# Altium schematic sheet схема варианта ДСД 23.8.SchDoc
size A3
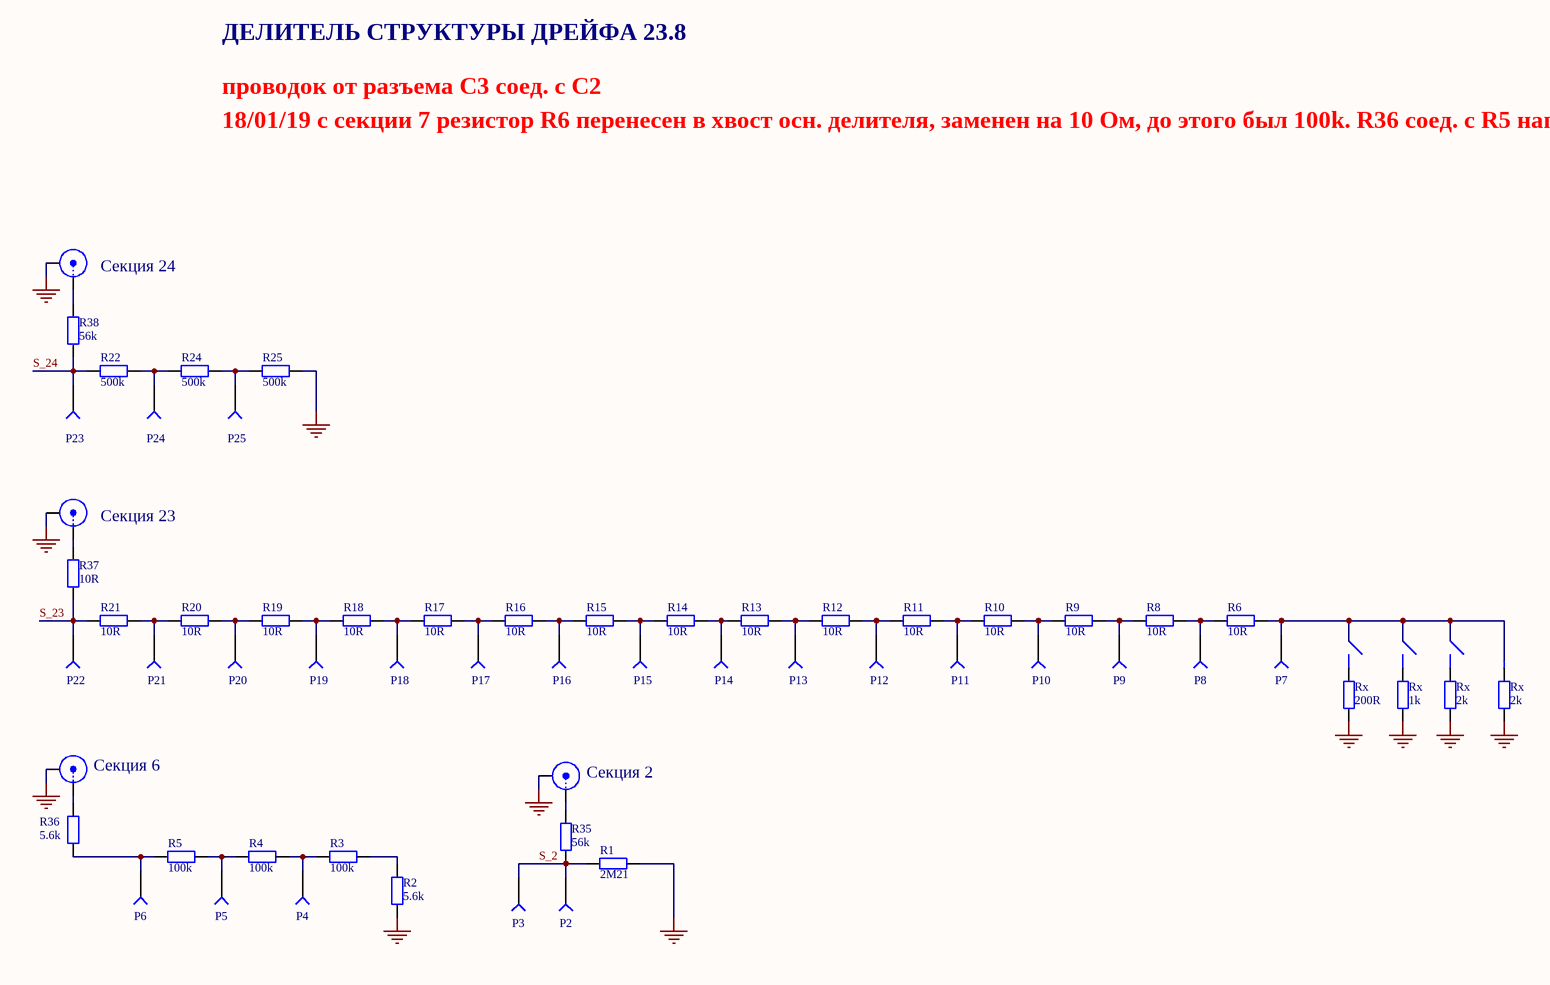
[diagram p0: схема варианта ДСД 23.8.SchDoc]

## Parts
(Parts that share a designator on the sheet are numbered #1, #2 ... from top to bottom, then left to right.)
P2  (no value)  [Pad 2x5mm]  (no BOM)
P3  (no value)  [Pad 2x5mm]  (no BOM)
P4  (no value)  [Pad 2x5mm]  (no BOM)
P5  (no value)  [Pad 2x5mm]  (no BOM)
P6  (no value)  [Pad 2x5mm]  (no BOM)
P7  (no value)  [Pad 2x5mm]  (no BOM)
P8  (no value)  [Pad 2x5mm]  (no BOM)
P9  (no value)  [Pad 2x5mm]  (no BOM)
P10  (no value)  [Pad 2x5mm]  (no BOM)
P11  (no value)  [Pad 2x5mm]  (no BOM)
P12  (no value)  [Pad 2x5mm]  (no BOM)
P13  (no value)  [Pad 2x5mm]  (no BOM)
P14  (no value)  [Pad 2x5mm]  (no BOM)
P15  (no value)  [Pad 2x5mm]  (no BOM)
P16  (no value)  [Pad 2x5mm]  (no BOM)
P17  (no value)  [Pad 2x5mm]  (no BOM)
P18  (no value)  [Pad 2x5mm]  (no BOM)
P19  (no value)  [Pad 2x5mm]  (no BOM)
P20  (no value)  [Pad 2x5mm]  (no BOM)
P21  (no value)  [Pad 2x5mm]  (no BOM)
P22  (no value)  [Pad 2x5mm]  (no BOM)
P23  (no value)  [Pad 2x5mm]  (no BOM)
P24  (no value)  [Pad 2x5mm]  (no BOM)
P25  (no value)  [Pad 2x5mm]  (no BOM)
R1  value 2M21  [Resistor Р1-35-2 1W Horizontal]  (hidden comment: Resistor)
R2  value 5.6k  [Resistor ТВО-1 1W Horizontal]  (hidden comment: Resistor)
R3  value 100k  [Resistor ТВО-1 1W Horizontal]  (hidden comment: Resistor)
R4  value 100k  [Resistor ТВО-1 1W Horizontal]  (hidden comment: Resistor)
R5  value 100k  [Resistor ТВО-1 1W Horizontal]  (hidden comment: Resistor)
R6  value 10R  [Resistor ТВО-1 1W Horizontal]  (hidden comment: Resistor)
R8  value 10R  [Resistor ТВО-1 1W Horizontal]  (hidden comment: Resistor)
R9  value 10R  [Resistor ТВО-1 1W Horizontal]  (hidden comment: Resistor)
R10  value 10R  [Resistor ТВО-1 1W Horizontal]  (hidden comment: Resistor)
R11  value 10R  [Resistor ТВО-1 1W Horizontal]  (hidden comment: Resistor)
R12  value 10R  [Resistor ТВО-1 1W Horizontal]  (hidden comment: Resistor)
R13  value 10R  [Resistor ТВО-1 1W Horizontal]  (hidden comment: Resistor)
R14  value 10R  [Resistor ТВО-1 1W Horizontal]  (hidden comment: Resistor)
R15  value 10R  [Resistor ТВО-1 1W Horizontal]  (hidden comment: Resistor)
R16  value 10R  [Resistor ТВО-1 1W Horizontal]  (hidden comment: Resistor)
R17  value 10R  [Resistor ТВО-1 1W Horizontal]  (hidden comment: Resistor)
R18  value 10R  [Resistor ТВО-1 1W Horizontal]  (hidden comment: Resistor)
R19  value 10R  [Resistor ТВО-1 1W Horizontal]  (hidden comment: Resistor)
R20  value 10R  [Resistor ТВО-1 1W Horizontal]  (hidden comment: Resistor)
R21  value 10R  [Resistor ТВО-1 1W Horizontal]  (hidden comment: Resistor)
R22  value 500k  [Resistor ТВО-1 1W Horizontal]  (hidden comment: Resistor)
R24  value 500k  [Resistor ТВО-1 1W Horizontal]  (hidden comment: Resistor)
R25  value 500k  [Resistor ТВО-1 1W Horizontal]  (hidden comment: Resistor)
R35  value 56k  [Resistor ТВО-1 1W Horizontal]  (hidden comment: Resistor)
R36  value 5.6k  [Resistor ТВО-1 1W Horizontal]  (hidden comment: Resistor)
R37  value 10R  [Resistor ТВО-1 1W Horizontal]  (hidden comment: Resistor)
R38  value 56k  [Resistor ТВО-1 1W Horizontal]  (hidden comment: Resistor)
Rx#1  value 200R  [Resistor ТВО-1 1W Horizontal]  (hidden comment: Resistor)
Rx#2  value 1k  [Resistor ТВО-1 1W Horizontal]  (hidden comment: Resistor)
Rx#3  value 2k  [Resistor ТВО-1 1W Horizontal]  (hidden comment: Resistor)
Rx#4  value 2k  [Resistor ТВО-1 1W Horizontal]  (hidden comment: Resistor)
Секция_2  HV-SYS  [HV-SYS]  (value not drawn)
Секция_6  HV-SYS  [HV-SYS]  (value not drawn)
Секция_23  HV-SYS  [HV-SYS]  (value not drawn)
Секция_24  HV-SYS  [HV-SYS]  (value not drawn)

## Nets
GND: R1.2 R2.1 R25.1 Rx#1.1 Rx#2.1 Rx#3.1 Rx#4.1 Секция_2.2(Y) Секция_6.2(Y) Секция_23.2(Y) Секция_24.2(Y)
S_2: P2.1 P3.1 R1.1 R35.1
S_23: P22.1 R21.1 R37.1
S_24: P23.1 R22.2 R38.1
NetP4_1: P4.1 R3.1 R4.2
NetP5_1: P5.1 R4.1 R5.2
NetP6_1: P6.1 R5.1 R36.1
NetP7_1: P7.1 R6.2
NetP8_1: P8.1 R6.1 R8.2
NetP9_1: P9.1 R8.1 R9.2
NetP10_1: P10.1 R9.1 R10.2
NetP11_1: P11.1 R10.1 R11.2
NetP12_1: P12.1 R11.1 R12.2
NetP13_1: P13.1 R12.1 R13.2
NetP14_1: P14.1 R13.1 R14.2
NetP15_1: P15.1 R14.1 R15.2
NetP16_1: P16.1 R15.1 R16.2
NetP17_1: P17.1 R16.1 R17.2
NetP18_1: P18.1 R17.1 R18.2
NetP19_1: P19.1 R18.1 R19.2
NetP20_1: P20.1 R19.1 R20.2
NetP21_1: P21.1 R20.1 R21.2
NetP24_1: P24.1 R22.1 R24.2
NetP25_1: P25.1 R24.1 R25.2
NetR2_2: R2.2 R3.2
NetR35_2: R35.2 Секция_2.1(X)
NetR36_2: R36.2 Секция_6.1(X)
NetR37_2: R37.2 Секция_23.1(X)
NetR38_2: R38.2 Секция_24.1(X)

Not connected (* = marked no-connect by the designer): Rx#1 2; Rx#2 2; Rx#3 2; Rx#4 2

## Notes on the sheet
- ДЕЛИТЕЛЬ СТРУКТУРЫ ДРЕЙФА 23.8
- проводок от разъема C3 соед. с С2
- 18/01/19 с секции 7 резистор R6 перенесен в хвост осн. делителя, заменен на 10 Ом, до этого был 100k. R36 соед. с R5 напрямую

## Library data of the parts
P2-P25 = Socket
R1-R6 R8-R22 R24 R25 R35-R38 Rx#1-Rx#4 = Resistors: Category: Резисторы; Type: *; Tolerance: *
Секция_2 Секция_6 Секция_23 Секция_24 = HV-SYS: LHEP JINR HV SYS 3 kV connector; Coaxial Termination: Through Hole Right Angle; Coaxial Cable Types: -; Category: Разъёмы